# EAGLE board Transfer_Register (EAGLE 9.6.2), part 1 of 2
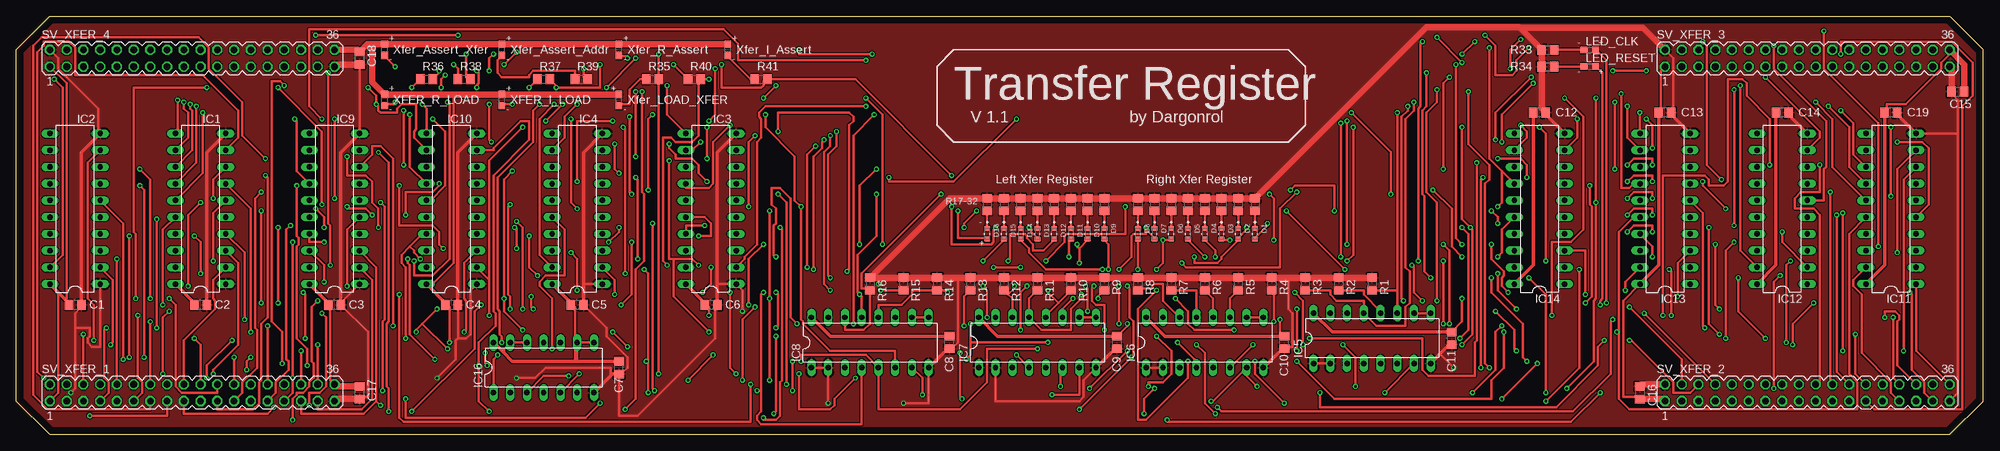
[diagram p1: board, top side]
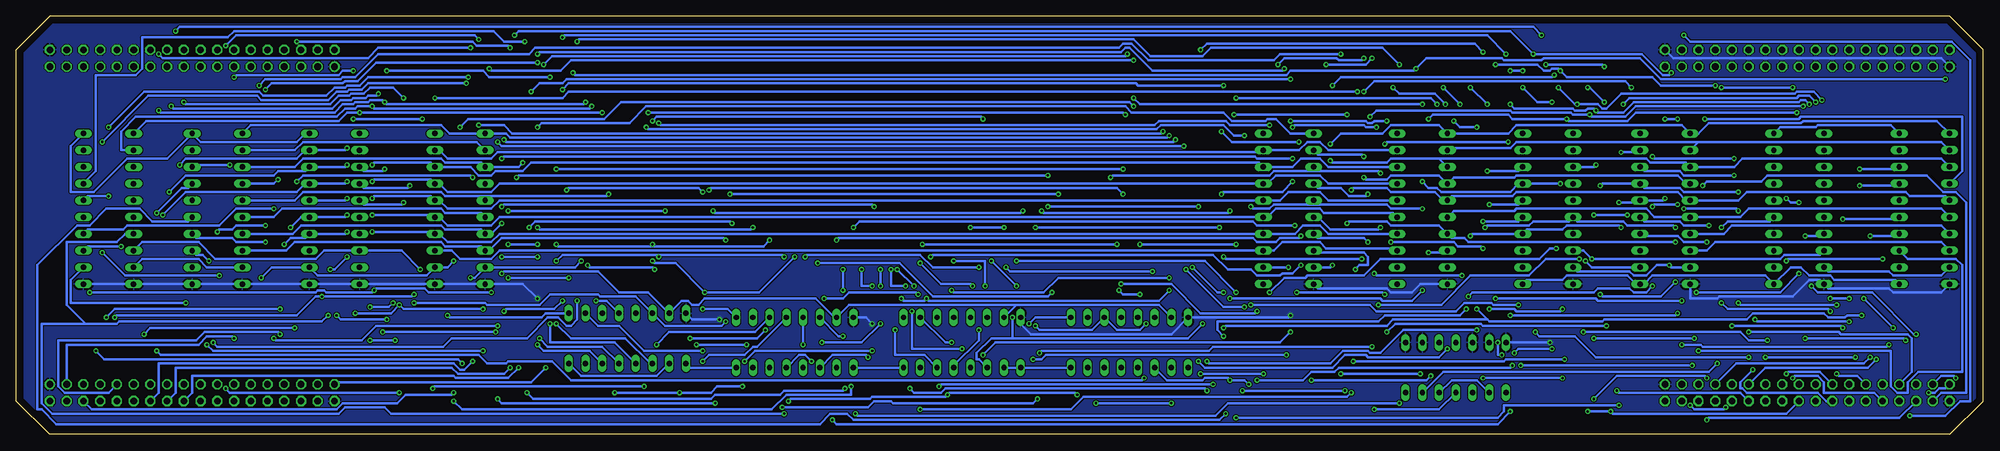
[diagram p2: board, bottom side, seen from below]

Size 298.45 x 63.5 mm. Coordinates in mm from the lower left corner, seen from the top.
Outline: 5.08,0 0,5.08 0,58.42 5.08,63.5 293.37,63.5 298.45,58.42 298.45,5.08 293.37,0 5.08,0
Copper layers (1*16): Top 0.035mm / dielectric 1.5mm / Bottom 0.035mm
Design rules "default *": minimum track width 16mil, minimum drill 0.35mm, track to track 6mil, track to pad 6mil, pad to pad 6mil, via to via 6mil, smd to smd 6mil, copper to edge 40mil, drill to drill 6mil, minimum pad ring 10mil, minimum via ring 8mil, stop-mask expansion 4mil, vias tented up to drill 0mil, thermal gap 10mil

## Footprints (pad centres in the part's own frame; a part is rotated, then mirrored left to right if it is on the bottom)
C0805 = smd 1.3 x 1.5: 1 -0.95,0; 2 0.95,0
LEDC1608X45N = smd 0.81 x 0.93: A 0.81,0; C -0.81,0
DIL20 = drill 0.813 long: 1 -11.43,-3.81; 2 -8.89,-3.81; 3 -6.35,-3.81; 4 -3.81,-3.81; 5 -1.27,-3.81; 6 1.27,-3.81; 7 3.81,-3.81; 8 6.35,-3.81; 9 8.89,-3.81; 10 11.43,-3.81; 11 11.43,3.81; 12 8.89,3.81; 13 6.35,3.81; 14 3.81,3.81; 15 1.27,3.81; 16 -1.27,3.81; 17 -3.81,3.81; 18 -6.35,3.81; 19 -8.89,3.81; 20 -11.43,3.81
DIL16 = drill 0.813 long: 1 -8.89,-3.81; 2 -6.35,-3.81; 3 -3.81,-3.81; 4 -1.27,-3.81; 5 1.27,-3.81; 6 3.81,-3.81; 7 6.35,-3.81; 8 8.89,-3.81; 9 8.89,3.81; 10 6.35,3.81; 11 3.81,3.81; 12 1.27,3.81; 13 -1.27,3.81; 14 -3.81,3.81; 15 -6.35,3.81; 16 -8.89,3.81
DIL14 = drill 0.813 long: 1 -7.62,-3.81; 2 -5.08,-3.81; 3 -2.54,-3.81; 4 0,-3.81; 5 2.54,-3.81; 6 5.08,-3.81; 7 7.62,-3.81; 8 7.62,3.81; 9 5.08,3.81; 10 2.54,3.81; 11 0,3.81; 12 -2.54,3.81; 13 -5.08,3.81; 14 -7.62,3.81
0603 = smd 1.1 x 1: 1 -0.85,0; 2 0.85,0
R0805 = smd 1.3 x 1.5: 1 -0.95,0; 2 0.95,0
MA18-2 = drill 1.016 octagon: 1 -21.59,-1.27; 2 -21.59,1.27; 3 -19.05,-1.27; 4 -19.05,1.27; 5 -16.51,-1.27; 6 -16.51,1.27; 7 -13.97,-1.27; 8 -13.97,1.27; 9 -11.43,-1.27; 10 -11.43,1.27; 11 -8.89,-1.27; 12 -8.89,1.27; 13 -6.35,-1.27; 14 -6.35,1.27; 15 -3.81,-1.27; 16 -3.81,1.27; 17 -1.27,-1.27; 18 -1.27,1.27; 19 1.27,-1.27; 20 1.27,1.27; 21 3.81,-1.27; 22 3.81,1.27; 23 6.35,-1.27; 24 6.35,1.27; 25 8.89,-1.27; 26 8.89,1.27; 27 11.43,-1.27; 28 11.43,1.27; 29 13.97,-1.27; 30 13.97,1.27; 31 16.51,-1.27; 32 16.51,1.27; 33 19.05,-1.27; 34 19.05,1.27; 35 21.59,-1.27; 36 21.59,1.27

## Placement (x,y rotation side)
C1  [C0805]  8.89,19.68 180 top
C2  [C0805]  27.94,19.68 180 top
C3  [C0805]  48.26,19.68 180 top
C4  [C0805]  66.04,19.68 180 top
C5  [C0805]  85.09,19.68 180 top
C6  [C0805]  105.41,19.68 180 top
C7  [C0805]  91.44,10.16 90 top
C8  [C0805]  141.6,13.97 90 top
C9  [C0805]  167,13.97 90 top
C10  [C0805]  192.41,13.97 90 top
C11  [C0805]  217.81,14.61 90 top
C12  [C0805]  231.14,48.9 180 top
C13  [C0805]  250.19,48.9 180 top
C14  [C0805]  267.97,48.9 180 top
C15  [C0805]  294.64,52.07 0 top
C16  [C0805]  246.38,6.35 270 top
C17  [C0805]  52.07,6.35 90 top
C18  [C0805]  52.07,57.15 90 top
C19  [C0805]  284.48,48.9 180 top
D1  LTST-C193KRKT-5A  [LEDC1608X45N]  187.96,30.48 270 top
D2  LTST-C193KRKT-5A  [LEDC1608X45N]  185.42,30.48 270 top
D3  LTST-C193KRKT-5A  [LEDC1608X45N]  182.88,30.48 270 top
D4  LTST-C193KRKT-5A  [LEDC1608X45N]  180.34,30.48 270 top
D5  LTST-C193KRKT-5A  [LEDC1608X45N]  177.8,30.48 270 top
D6  LTST-C193KRKT-5A  [LEDC1608X45N]  175.26,30.48 270 top
D7  LTST-C193KRKT-5A  [LEDC1608X45N]  172.72,30.48 270 top
D8  LTST-C193KRKT-5A  [LEDC1608X45N]  170.18,30.48 270 top
D9  LTST-C193KRKT-5A  [LEDC1608X45N]  165.1,30.48 270 top
D10  LTST-C193KRKT-5A  [LEDC1608X45N]  162.56,30.48 270 top
D11  LTST-C193KRKT-5A  [LEDC1608X45N]  160.02,30.48 270 top
D12  LTST-C193KRKT-5A  [LEDC1608X45N]  157.48,30.48 270 top
D13  LTST-C193KRKT-5A  [LEDC1608X45N]  154.94,30.48 270 top
D14  LTST-C193KRKT-5A  [LEDC1608X45N]  152.4,30.48 270 top
D15  LTST-C193KRKT-5A  [LEDC1608X45N]  149.86,30.48 270 top
D16  LTST-C193KRKT-5A  [LEDC1608X45N]  147.32,30.48 270 top
IC1  74HCT245N  [DIL20]  27.94,34.29 90 top
IC2  74HCT245N  [DIL20]  8.89,34.29 90 top
IC3  74HCT245N  [DIL20]  105.41,34.29 90 top
IC4  74HCT245N  [DIL20]  85.09,34.29 90 top
IC5  74HCT173N  [DIL16]  205.74,14.61 0 top
IC6  74HCT173N  [DIL16]  180.34,13.97 0 top
IC7  74HCT173N  [DIL16]  154.94,13.97 0 top
IC8  74HCT173N  [DIL16]  129.54,13.97 0 top
IC9  74HCT245N  [DIL20]  48.26,34.29 90 top
IC10  74HCT245N  [DIL20]  66.04,34.29 90 top
IC11  74HCT245N  [DIL20]  284.48,34.29 90 top
IC12  74HCT245N  [DIL20]  267.97,34.29 90 top
IC13  74HCT245N  [DIL20]  250.19,34.29 90 top
IC14  74HCT245N  [DIL20]  231.14,34.29 90 top
IC16  74LS266N  [DIL14]  80.01,10.16 0 top
LED_CLK  LTST-C193TBKT-5A  [0603]  238.76,58.42 0 top
LED_RESET  LTST-C193TBKT-5A  [0603]  238.76,55.88 0 top
LED_XFER_ASSERT_ADDR  LTST-C193TBKT-5A  [0603]  73.66,58.42 90 top
LED_XFER_ASSERT_XFER  LTST-C193TBKT-5A  [0603]  55.88,58.42 90 top
LED_XFER_L_ASSERT  LTST-C193TBKT-5A  [0603]  107.95,58.42 90 top
LED_XFER_L_LOAD  LTST-C193TBKT-5A  [0603]  73.66,50.8 90 top
LED_XFER_LOAD_XFER  LTST-C193TBKT-5A  [0603]  91.44,50.8 90 top
LED_XFER_R_ASSERT  LTST-C193TBKT-5A  [0603]  91.44,58.42 90 top
LED_XFER_R_LOAD  LTST-C193TBKT-5A  [0603]  55.88,50.8 90 top
R1  [R0805]  205.74,22.86 270 top
R2  [R0805]  200.66,22.86 270 top
R3  [R0805]  195.58,22.86 270 top
R4  [R0805]  190.5,22.86 270 top
R5  [R0805]  185.42,22.86 270 top
R6  [R0805]  180.34,22.86 270 top
R7  [R0805]  175.26,22.86 270 top
R8  [R0805]  170.18,22.86 270 top
R9  [R0805]  165.1,22.86 270 top
R10  [R0805]  160.02,22.86 270 top
R11  [R0805]  154.94,22.86 270 top
R12  [R0805]  149.86,22.86 270 top
R13  [R0805]  144.78,22.86 270 top
R14  [R0805]  139.7,22.86 270 top
R15  [R0805]  134.62,22.86 270 top
R16  [R0805]  129.54,22.86 270 top
R17  [R0805]  187.96,34.92 270 top
R18  [R0805]  185.42,34.92 270 top
R19  [R0805]  182.88,34.92 270 top
R20  [R0805]  180.34,34.92 270 top
R21  [R0805]  177.8,34.92 270 top
R22  [R0805]  175.26,34.92 270 top
R23  [R0805]  172.72,34.92 270 top
R24  [R0805]  170.18,34.92 270 top
R25  [R0805]  165.1,34.92 270 top
R26  [R0805]  162.56,34.92 270 top
R27  [R0805]  160.02,34.92 270 top
R28  [R0805]  157.48,34.92 270 top
R29  [R0805]  154.94,34.92 270 top
R30  [R0805]  152.4,34.92 270 top
R31  [R0805]  149.86,34.92 270 top
R32  [R0805]  147.32,34.92 270 top
R33  [R0805]  232.41,58.42 0 top
R34  [R0805]  232.41,55.88 0 top
R35  [R0805]  96.52,53.98 0 top
R36  [R0805]  62.23,53.98 0 top
R37  [R0805]  80.01,53.98 0 top
R38  [R0805]  67.94,53.98 0 top
R39  [R0805]  85.72,53.98 0 top
R40  [R0805]  102.87,53.98 0 top
R41  [R0805]  113.03,53.98 0 top
SV_XFER_1  [MA18-2]  26.67,6.35 0 top
SV_XFER_2  [MA18-2]  271.78,6.35 0 top
SV_XFER_3  [MA18-2]  271.78,57.15 0 top
SV_XFER_4  [MA18-2]  26.67,57.15 0 top

## Tracks (layer width: path | path; a pad name or v marks a point on that pad's centre or on a via)
!CTRL_XFER_ASSERT_ADDR  (via drill 0.35)
  Top 0.406: v86.04,55.56 86.04,54.29 86.36,53.98 R39.2 | v5.71,53.98 6.99,52.7 6.99,27.3 IC2.19 | v229.24,11.11 228.6,11.75 228.6,16.83 223.84,21.59 v223.84,23.81 | v214.63,23.81 213.68,24.77 213.68,36.2 213.36,36.51 213.36,49.21 214,49.85 v214,54.93
  Bottom 0.406: v5.71,53.98 48.9,53.98 52.07,57.15 66.67,57.15 66.99,56.83 72.71,56.83 73.03,57.15 84.45,57.15 v86.04,55.56 86.36,55.24 105.09,55.24 105.73,54.61 213.68,54.61 v214,54.93 | IC1.19 23.5,24.77 14.29,24.77 13.65,24.13 6.35,24.13 IC2.19 | SV_XFER_2.23 276.86,6.35 276.86,10.79 232.09,10.79 231.14,9.84 230.5,9.84 v229.24,11.11 | v214.63,23.81 v223.84,23.81
!CTRL_XFER_ASSERT_XFER  (via drill 0.35)
  Top 0.406: v68.26,57.78 68.26,54.29 68.58,53.98 R38.2 | v47.31,54.93 47.31,32.07 47.62,31.75 v47.62,25.72 | SV_XFER_2.25 281.94,3.81 295.27,3.81 295.27,49.85 296.86,51.44 296.86,56.52 293.69,59.69 276.86,59.69 v276.86,57.78 | v229.55,58.74 227.65,56.83 227.65,55.24 227.01,54.61 224.47,54.61 224.47,59.05 v222.88,60.64
  Bottom 0.406: v47.31,54.93 47.62,54.61 48.58,54.61 51.75,57.78 v68.26,57.78 71.75,61.28 222.25,61.28 v222.88,60.64 | IC9.19 47.31,25.4 v47.62,25.72 49.53,25.72 51.12,24.13 53.02,24.13 53.66,24.77 61.59,24.77 IC10.19 | v276.86,57.78 276.23,57.15 245.11,57.15 243.52,58.74 v229.55,58.74
!CTRL_XFER_L_ASSERT  (via drill 0.35)
  Top 0.406: v107,56.2 107,52.7 113.03,52.7 113.35,53.02 113.35,53.66 113.67,53.98 R41.2 127.32,53.98 v141.92,39.37 | v89.53,52.7 v93.98,57.15 | v81.6,50.16 79.38,47.94 79.38,27.3 IC4.19 | v222.25,10.16 222.25,38.73 v222.57,39.05
  Bottom 0.406: v107,56.2 106.05,57.15 98.11,57.15 97.79,56.83 94.3,56.83 v93.98,57.15 | v89.53,52.7 88.58,51.75 83.19,51.75 v81.6,50.16 | SV_XFER_2.19 271.78,6.35 271.78,8.89 232.09,8.89 231.78,8.57 223.84,8.57 v222.25,10.16 | v222.57,39.05 222.25,39.37 v141.92,39.37
!CTRL_XFER_L_LOAD  (via drill 0.35)
  Top 0.406: v79.38,50.16 78.42,49.21 78.42,44.45 73.03,39.05 73.03,19.05 73.34,18.73 73.34,15.24 73.66,14.92 v73.66,13.97 | v73.03,12.06 72.39,11.43 IC16.1 | R37.2 81.92,53.02 v81.92,52.7 88.58,52.7 v88.58,56.2 | v229.55,23.81 232.09,21.27 v232.09,6.35 | v213.36,59.69 213.04,59.37 213.04,49.85 212.72,49.53 v212.72,26.35
  Bottom 0.406: v79.38,50.16 v81.92,52.7 | v73.66,13.97 73.66,12.06 v73.03,12.06 | v229.55,23.81 228.92,23.81 IC14.19 213.68,25.4 v212.72,26.35 | v232.09,6.35 232.41,6.03 239.4,6.03 240.66,4.76 248.92,4.76 249.87,3.81 287.02,3.81 SV_XFER_2.31 | v88.58,56.2 91.12,58.74 117.16,58.74 118.43,57.47 126.36,57.47 128.91,60.01 213.04,60.01 v213.36,59.69
!CTRL_XFER_LOAD_XFER  (via drill 0.35)
  Top 0.406: SV_XFER_2.29 284.48,6.35 284.48,7.94 280.04,12.38 280.04,21.27 278.76,22.54 278.76,23.5 IC11.19 | v97.47,9.21 R35.2 | IC16.5 v85.41,9.21 | IC12.19 261.62,27.94 v261.62,53.02 | R35.2 v97.47,57.78 | R35.2
  Bottom 0.406: IC12.19 269.56,25.4 270.83,26.67 279.4,26.67 IC11.19 | v85.41,9.21 v97.47,9.21 | IC16.2 76.83,8.26 80.64,8.26 IC16.5 | v261.62,53.02 260.67,53.98 249.24,53.98 248.92,54.29 247.01,54.29 243.52,57.78 220.66,57.78 219.71,58.74 131.13,58.74 130.49,59.37 129.22,59.37 126.68,56.83 107.63,56.83 106.68,57.78 v97.47,57.78
!CTRL_XFER_R_ASSERT  (via drill 0.35)
  Top 0.406: v98.74,25.72 98.11,26.35 98.11,45.09 99.38,45.09 100.01,44.45 102.55,44.45 103.5,45.4 103.5,53.98 R40.2 v105.09,53.98 | v223.52,10.16 222.88,10.79 222.88,38.1 223.52,38.73 223.52,40.96 220.34,44.13 v220.34,52.07
  Bottom 0.406: v98.74,25.72 99.06,25.4 IC3.19 | SV_XFER_2.21 274.32,6.35 274.32,10.16 232.41,10.16 231.46,9.21 224.47,9.21 v223.52,10.16 | v220.34,52.07 219.07,53.34 215.58,53.34 214.95,53.98 v105.09,53.98
!CTRL_XFER_R_LOAD  (via drill 0.35)
  Top 0.406: IC13.19 244.16,23.18 v244.16,21.91 | v287.34,21.59 287.65,21.27 287.65,9.84 289.56,7.94 289.56,6.35 SV_XFER_2.33 | v64.14,55.24 64.14,54.93 R36.2 | v40.64,53.02 40.01,53.66 38.73,53.66 38.73,17.14 40.32,15.56 v40.32,10.79 | v226.38,21.59 225.43,22.54 225.43,23.81 225.74,24.13 225.74,24.77 223.84,26.67 v223.84,28.89 | v219.39,28.89 218.44,29.84 v218.44,56.2 | v129.86,57.78 118.75,57.78 v118.75,58.42 | v73.98,56.2 v75.88,58.1
  Bottom 0.406: v287.34,21.59 253.05,21.59 252.73,21.91 251.78,21.91 251.46,21.59 244.47,21.59 v244.16,21.91 243.84,22.23 236.54,22.23 235.9,21.59 v226.38,21.59 | v40.64,53.02 48.9,53.02 50.16,54.29 63.18,54.29 v64.14,55.24 64.45,55.56 65.41,55.56 65.72,55.24 66.67,55.24 67.63,56.2 v73.98,56.2 | v40.32,10.79 41.59,9.53 81.92,9.53 IC16.6 | v219.39,28.89 v223.84,28.89 | v218.44,56.2 217.17,57.47 130.18,57.47 v129.86,57.78 | v118.75,58.42 117.79,59.37 77.15,59.37 v75.88,58.1
BUS_!CLK  (via drill 0.35)
  Top 0.406: IC8.7 137.48,8.57 v137.48,6.03 | v157.16,6.03 161.29,6.03 IC7.7 | 186.06,9.53 181.61,5.08 v181.29,5.08 | v207.65,6.35 IC5.7 | 186.06,9.53 v188.28,7.3 | 186.06,9.53 IC6.7 | SV_XFER_2.6 254,6.35 251.46,6.35 251.46,7.94 245.11,14.29 v244.79,14.29 | v240.98,14.29 240.03,13.34 240.03,10.48 233.68,4.13 197.8,4.13 v197.8,6.35
  Bottom 0.406: v137.48,6.03 137.79,6.35 156.84,6.35 v157.16,6.03 157.48,5.71 168.59,5.71 168.91,5.4 180.97,5.4 v181.29,5.08 | v207.65,6.35 v197.8,6.35 193.04,6.35 192.09,7.3 v188.28,7.3 | v240.98,14.29 v244.79,14.29
BUS_ADDRESS_BUS_0  (via drill 0.35)
  Top 0.406: IC1.9 33.66,45.09 33.66,49.21 28.26,54.61 8.89,54.61 8.89,58.74 7.94,59.69 4.13,59.69 4.13,59.05 3.17,58.1 3.17,9.53 v4.13,8.57
  Bottom 0.406: v4.13,8.57 4.45,8.89 6.35,8.89 SV_XFER_1.4
BUS_ADDRESS_BUS_1  (via drill 0.35)
  Top 0.406: IC1.8 29.84,38.73 v29.84,35.88 | v27.94,35.24 26.04,33.34 v26.04,22.54 | SV_XFER_1.6 v10.16,15.24
  Bottom 0.406: v29.84,35.88 29.21,35.24 v27.94,35.24 | v26.04,22.54 25.08,21.59 16.83,21.59 10.48,15.24 v10.16,15.24
BUS_ADDRESS_BUS_2  (via drill 0.35)
  Top 0.406: IC1.7 35.56,34.29 v35.56,15.56
  Bottom 0.406: v35.56,15.56 21.91,15.56 21.59,15.24 11.43,15.24 10.79,14.61 10.79,9.53 SV_XFER_1.8
BUS_ADDRESS_BUS_3  (via drill 0.35)
  Top 0.406: IC1.6 29.84,33.66 v29.84,26.35 | SV_XFER_1.10 v15.24,26.67
  Bottom 0.406: v29.84,26.35 29.53,26.67 v15.24,26.67
BUS_ADDRESS_BUS_4  (via drill 0.35)
  Top 0.406: v39.69,20 v39.69,31.43 | v23.18,18.73 22.23,17.78 v22.23,9.21
  Bottom 0.406: IC1.5 32.38,32.38 38.73,32.38 v39.69,31.43 | v39.69,20 38.73,19.05 23.5,19.05 v23.18,18.73 | v22.23,9.21 21.91,8.89 19.05,8.89 SV_XFER_1.12
BUS_ADDRESS_BUS_5  (via drill 0.35)
  Top 0.406: IC1.4 34.61,27.62 v34.61,17.46 | SV_XFER_1.14 v20.32,17.14
  Bottom 0.406: v34.61,17.46 34.29,17.14 v20.32,17.14
BUS_ADDRESS_BUS_6  (via drill 0.35)
  Top 0.406: IC1.3 33.66,26.04 33.66,13.65 29.84,9.84 v29.84,9.21
  Bottom 0.406: v29.84,9.21 29.53,9.53 24.77,9.53 SV_XFER_1.16
BUS_ADDRESS_BUS_7
  Top 0.406: IC1.2 29.84,23.5 29.84,20.64 30.16,20.32 30.16,19.05 25.4,14.29 SV_XFER_1.18
BUS_ADDRESS_BUS_8  (via drill 0.35)
  Top 0.406: IC2.9 10.79,41.27 10.79,20.64 11.75,19.68 v11.75,14.29 | v26.99,14.61 27.94,13.65 SV_XFER_1.20
  Bottom 0.406: v11.75,14.29 12.06,14.61 v26.99,14.61
BUS_ADDRESS_BUS_9  (via drill 0.35)
  Top 0.406: v18.73,40.32 20.32,38.73 v20.32,20.64 | v23.18,20.64 24.13,19.68 24.13,7.3 25.08,6.35 30.48,6.35 SV_XFER_1.22
  Bottom 0.406: IC2.8 13.02,40.32 v18.73,40.32 | v23.18,20.64 v20.32,20.64
BUS_ADDRESS_BUS_10  (via drill 0.35)
  Top 0.406: v18.73,37.78 19.37,37.15 v19.37,11.75 | SV_XFER_1.24 v33.02,11.75
  Bottom 0.406: IC2.7 13.02,37.78 v18.73,37.78 | v33.02,11.75 v19.37,11.75
BUS_ADDRESS_BUS_11  (via drill 0.35)
  Top 0.406: IC2.6 16.19,32.07 v16.19,11.43
  Bottom 0.406: v16.19,11.43 17.46,10.16 33.02,10.16 SV_XFER_1.26
BUS_ADDRESS_BUS_12  (via drill 0.35)
  Top 0.406: v21.27,16.19 v21.27,32.7 | SV_XFER_1.28 v38.1,16.51
  Bottom 0.406: IC2.5 13.02,32.7 v21.27,32.7 | v21.27,16.19 21.59,16.51 v38.1,16.51
BUS_ADDRESS_BUS_13  (via drill 0.35)
  Top 0.406: v17.14,11.75 v17.14,30.16
  Bottom 0.406: IC2.4 13.02,30.16 v17.14,30.16 | v17.14,11.75 18.1,10.79 37.47,10.79 SV_XFER_1.30
BUS_ADDRESS_BUS_14  (via drill 0.35)
  Top 0.406: SV_XFER_1.32 v43.18,12.7
  Bottom 0.406: IC2.3 11.43,26.67 4.13,26.67 3.17,25.72 3.17,9.53 9.84,9.53 11.43,7.94 11.43,6.35 13.02,6.35 13.97,7.3 13.97,12.7 v43.18,12.7
BUS_ADDRESS_BUS_15  (via drill 0.35)
  Top 0.406: IC2.2 14.61,23.5 14.61,13.97 v14.29,13.65 | SV_XFER_1.34 v45.72,13.65
  Bottom 0.406: v14.29,13.65 14.61,13.34 42.55,13.34 42.86,13.65 v45.72,13.65
BUS_CLK  (via drill 0.35)
  Top 0.406: LED_CLK.2 239.71,58.42 241.3,56.83 v241.3,20 | v244.79,19.37 252.73,11.43 SV_XFER_2.4
  Bottom 0.406: v241.3,20 241.94,19.37 v244.79,19.37
BUS_MAIN_BUS_0  (via drill 0.35)
  Top 0.406: IC14.9 236.85,45.09 v236.85,47.94 | v247.33,47.94 248.28,46.99 v248.28,43.5 | SV_XFER_2.20 273.69,8.26 273.69,33.34 272.73,34.29 269.88,34.29 269.88,35.88 270.83,36.83 273.69,36.83 v273.69,40.96
  Bottom 0.406: IC4.9 99.38,43.18 100.65,44.45 102.55,44.45 103.82,43.18 IC3.9 109.54,42.86 225.43,42.86 226.38,41.91 233.04,41.91 234.31,43.18 IC14.9 | v247.33,47.94 v236.85,47.94 | v248.28,43.5 248.6,43.18 IC13.9 254.63,43.18 255.91,41.91 272.73,41.91 v273.69,40.96
BUS_MAIN_BUS_1  (via drill 0.35)
  Top 0.406: v244.47,40.96 245.43,41.91 248.28,41.91 v248.28,40.96 | SV_XFER_2.22 275.27,7.94 v275.27,36.83
  Bottom 0.406: IC4.8 99.38,40.64 100.65,41.91 103.5,41.91 104.78,40.64 IC3.8 109.86,41.27 220.34,41.27 221.62,40.01 225.74,40.01 226.38,39.37 228.28,39.37 229.55,40.64 IC14.8 235.59,41.27 244.16,41.27 v244.47,40.96 | v248.28,40.96 248.6,40.64 IC13.8 254.63,40.01 258.76,40.01 259.4,39.37 272.73,39.37 v275.27,36.83
BUS_MAIN_BUS_2  (via drill 0.35)
  Top 0.406: v244.47,38.42 245.43,39.37 248.28,39.37 v248.28,38.42 | SV_XFER_2.24 276.23,9.53 v276.23,33.34
  Bottom 0.406: IC4.7 99.38,38.1 100.65,39.37 107.31,39.37 108.58,38.1 IC3.7 225.11,38.1 226.38,36.83 233.04,36.83 234.31,38.1 IC14.7 235.59,38.73 244.16,38.73 v244.47,38.42 | v248.28,38.42 248.6,38.1 IC13.7 254.63,38.1 255.91,36.83 272.73,36.83 v276.23,33.34
BUS_MAIN_BUS_3  (via drill 0.35)
  Top 0.406: v244.47,35.88 245.43,36.83 248.28,36.83 v248.28,35.88 | SV_XFER_2.26 279.08,9.21 v279.08,15.24 | v256.22,16.19 255.91,16.51 255.91,33.66 IC13.6
  Bottom 0.406: IC4.6 99.38,35.56 100.65,36.83 105.41,36.83 106.68,35.56 IC3.6 225.11,35.56 226.38,34.29 233.04,34.29 234.31,35.56 IC14.6 235.59,36.2 244.16,36.2 v244.47,35.88 | v248.28,35.88 248.6,35.56 IC13.6 | v279.08,15.24 278.13,16.19 v256.22,16.19
BUS_MAIN_BUS_4  (via drill 0.35)
  Top 0.406: v244.47,33.34 245.43,34.29 248.28,34.29 v248.28,33.34 | v258.44,15.24 256.86,16.83 v256.86,31.43
  Bottom 0.406: IC4.5 89.53,33.66 100.01,33.66 100.65,34.29 107.31,34.29 108.58,33.02 IC3.5 225.11,33.02 226.38,31.75 233.04,31.75 234.31,33.02 IC14.5 235.27,33.34 v244.47,33.34 | v248.28,33.34 248.6,33.02 IC13.5 255.27,33.02 v256.86,31.43 | SV_XFER_2.28 284.48,6.35 291.15,6.35 292.1,7.3 292.1,14.29 271.14,14.29 269.88,15.56 258.76,15.56 v258.44,15.24
BUS_MAIN_BUS_5  (via drill 0.35)
  Top 0.406: v244.47,30.8 245.43,31.75 248.28,31.75 v248.28,30.8 | SV_XFER_2.30 284.8,8.57 v284.8,17.78 | v258.44,19.05 257.81,19.68 v257.81,28.89
  Bottom 0.406: IC4.4 99.38,30.48 100.65,31.75 103.19,31.75 104.46,30.48 IC3.4 225.11,30.48 226.38,29.21 233.04,29.21 234.31,30.48 IC14.4 235.27,30.8 v244.47,30.8 | v248.28,30.8 248.6,30.48 IC13.4 254.63,29.84 256.86,29.84 v257.81,28.89 | v284.8,17.78 283.53,19.05 v258.44,19.05
BUS_MAIN_BUS_6  (via drill 0.35)
  Top 0.406: IC14.3 238.12,27.94 v238.12,21.27 | v252.09,20.95 252.09,26.04 IC13.3 | SV_XFER_2.32 285.43,10.48 285.43,17.14 285.75,17.46 285.75,18.1 285.12,18.73 283.53,18.73 v283.53,17.78
  Bottom 0.406: IC4.3 89.22,28.26 99.69,28.26 100.65,29.21 106.36,29.21 107.63,27.94 IC3.3 225.11,27.94 226.38,26.67 231.14,26.67 232.41,27.94 IC14.3 | v238.12,21.27 238.44,20.95 v252.09,20.95 253.05,20.95 255.91,18.1 283.21,18.1 v283.53,17.78
BUS_MAIN_BUS_7  (via drill 0.35)
  Top 0.406: IC4.2 90.81,23.5 v90.81,21.27 | v104.14,21.59 105.41,22.86 v105.41,25.4 | v265.43,14.61 261.3,18.73 v261.3,23.81 | IC3.2 110.49,26.67 110.49,26.99 112.39,28.89 112.39,44.45 113.03,45.09 113.03,47.94 112.71,48.26 112.71,48.9 113.67,49.85 v128.91,49.85 | v231.14,46.67 232.09,45.72 v232.09,26.35
  Bottom 0.406: v90.81,21.27 91.12,21.59 v104.14,21.59 | IC3.2 v105.41,25.4 | SV_XFER_2.34 290.83,13.65 270.83,13.65 269.56,14.92 265.75,14.92 v265.43,14.61 | v261.3,23.81 259.71,25.4 IC13.2 252.73,24.13 236.22,24.13 IC14.2 233.04,25.4 v232.09,26.35 | v128.91,49.85 129.54,50.48 206.69,50.48 209.23,47.94 229.87,47.94 v231.14,46.67
BUS_RESET  (via drill 0.35)
  Top 0.406: v240.35,19.68 240.35,20.32 240.66,20.64 240.66,54.93 239.71,55.88 LED_RESET.2 | SV_XFER_2.8 v247.01,18.41 | v227.65,19.05 224.79,21.91 v224.79,24.45
  Bottom 0.406: v247.01,18.41 241.62,18.41 v240.35,19.68 239.71,19.05 v227.65,19.05 | IC8.15 125.09,19.68 146.69,19.68 | IC7.15 146.69,19.68 | 146.69,19.68 172.09,19.68 IC6.15 174.31,17.78 177.16,20.64 193.99,20.64 194.94,19.68 195.9,19.68 196.53,20.32 197.49,20.32 IC5.15 202.56,21.59 207.01,21.59 210.19,24.77 224.47,24.77 v224.79,24.45
BUS_XFER_BUS_0  (via drill 0.35)
  Top 0.406: IC10.9 72.39,43.18 72.39,43.5 76.52,47.62 77.79,47.62 77.79,44.77 72.39,39.37 72.39,18.73 72.71,18.41 72.71,16.51 70.17,13.97 v70.17,10.48 70.17,5.08 v71.75,3.49 | v44.13,10.48 44.13,13.02 42.55,14.61 42.55,28.57 42.86,28.89 42.86,29.84 42.55,30.16 v42.55,37.78 | IC11.9 285.43,40.32 v285.43,27.62 | v267.65,24.13 266.7,23.18 v266.7,6.99 | v240.35,6.35 235.9,1.91 174.62,1.91 v174.62,2.22
  Bottom 0.406: v44.13,10.48 v70.17,10.48 | v42.55,37.78 41.91,38.42 33.66,38.42 32.7,39.37 8.57,39.37 6.03,36.83 4.13,36.83 2.54,35.24 2.54,6.35 6.35,6.35 SV_XFER_1.3 | v285.43,27.62 281.94,24.13 v267.65,24.13 | v266.7,6.99 266.06,6.35 v240.35,6.35 | v174.62,2.22 173.99,1.59 73.66,1.59 v71.75,3.49
BUS_XFER_BUS_1  (via drill 0.35)
  Top 0.406: v75.25,40.01 73.98,38.73 v73.98,20.64 73.98,18.73 v76.83,15.88 | v45.72,20.32 44.77,19.37 44.77,11.11 45.09,10.79 45.09,8.57 44.45,7.94 44.45,7.3 43.5,6.35 42.55,6.35 42.55,6.03 41.91,5.4 v41.91,2.22 | IC11.8 286.38,38.73 v286.38,12.7 | v225.43,5.4 v230.82,10.79 | v192.41,4.76 187.96,9.21 v187.96,11.11 | v162.88,6.99 v168.59,12.7 | v117.79,11.11 v117.79,6.67
  Bottom 0.406: IC10.8 70.48,40.01 v75.25,40.01 | v73.98,20.64 58.74,20.64 58.42,20.32 v45.72,20.32 | v41.91,2.22 41.59,2.54 12.7,2.54 SV_XFER_1.5 | v286.38,12.7 285.12,11.43 231.46,11.43 v230.82,10.79 | v225.43,5.4 224.79,4.76 v192.41,4.76 | v187.96,11.11 186.37,12.7 v168.59,12.7 | v162.88,6.99 162.24,6.35 158.12,6.35 157.48,6.99 118.11,6.99 v117.79,6.67 | v117.79,11.11 117.47,10.79 99.06,10.79 97.16,12.7 93.34,12.7 93.03,12.38 91.44,12.38 87.95,15.88 v76.83,15.88
BUS_XFER_BUS_2  (via drill 0.35)
  Top 0.406: v64.14,38.1 64.14,37.78 63.18,36.83 59.05,36.83 v59.05,33.34 | v53.98,33.34 53.02,34.29 50.16,34.29 v50.16,34.61 | v46.35,34.92 46.35,46.04 v39.69,52.7 | v28.89,52.7 17.78,52.7 17.78,30.8 18.1,30.48 v18.1,20.64 | v13.65,16.19 13.34,15.88 13.34,8.57 13.97,7.94 13.97,6.35 SV_XFER_1.7 | v219.39,57.78 v221.3,59.69 | v106.05,55.56 106.05,48.58 v105.09,47.62 | v90.49,47.62 85.09,47.62 v85.09,38.42
  Bottom 0.406: v64.14,38.1 IC10.7 70.48,38.1 71.75,36.83 82.23,36.83 82.87,37.47 84.14,37.47 v85.09,38.42 | v53.98,33.34 v59.05,33.34 | v50.16,34.61 49.85,34.92 v46.35,34.92 | v28.89,52.7 v39.69,52.7 | v13.65,16.19 v18.1,20.64 | IC11.7 286.38,40.01 286.38,54.61 280.35,54.61 279.4,55.56 279.4,60.33 266.38,60.33 265.43,61.28 226.06,61.28 224.47,59.69 v221.3,59.69 | v219.39,57.78 219.07,58.1 130.81,58.1 130.18,58.74 129.54,58.74 126.05,55.24 106.36,55.24 v106.05,55.56 | v105.09,47.62 93.66,47.62 93.34,47.31 92.71,47.31 92.39,47.62 v90.49,47.62
BUS_XFER_BUS_3  (via drill 0.35)
  Top 0.406: v74.93,34.92 74.61,34.61 74.61,21.27 74.93,20.95 v74.93,19.05 | 61.59,16.83 60.64,15.88 v60.64,15.56 | 61.59,16.83 v63.82,19.05 | v32.7,14.29 28.89,10.48 v28.89,8.57 | v284.48,46.67 v284.48,36.2 | v229.87,54.29 224.47,48.9 v224.47,44.77 | v122.56,44.77 122.24,44.45 122.24,43.5 120.97,42.23 v120.97,25.08 | v112.08,19.37 110.17,17.46 v110.17,8.26 | v71.44,10.48 71.12,10.79 v71.12,12.38 | 61.59,16.83 v65.41,13.02
  Bottom 0.406: IC10.6 70.48,34.92 v74.93,34.92 | v74.93,19.05 71.12,19.05 70.8,18.73 64.14,18.73 v63.82,19.05 | v60.64,15.56 36.83,15.56 35.56,14.29 v32.7,14.29 | v28.89,8.57 28.57,8.89 25.08,8.89 24.13,7.94 24.13,6.35 16.51,6.35 SV_XFER_1.9 | IC11.6 287.65,36.2 v284.48,36.2 | v284.48,46.67 279.08,52.07 261.62,52.07 260.99,51.44 251.46,51.44 250.19,52.7 248.6,52.7 248.28,53.02 246.38,53.02 245.11,54.29 v229.87,54.29 | v224.47,44.77 224.16,44.45 122.87,44.45 v122.56,44.77 | v120.97,25.08 115.25,19.37 v112.08,19.37 | v110.17,8.26 103.19,8.26 101.92,9.53 98.42,9.53 97.79,10.16 71.75,10.16 v71.44,10.48 | v71.12,12.38 70.48,13.02 v65.41,13.02
BUS_XFER_BUS_4  (via drill 0.35)
  Top 0.406: v75.88,32.38 76.83,31.43 v76.83,19.05 | v18.41,18.1 18.41,8.57 19.05,7.94 19.05,6.35 SV_XFER_1.11 | IC11.5 290.19,34.92 290.19,43.5 289.24,44.45 v285.43,44.45 | v230.19,53.34 225.43,48.58 v225.43,44.45 | v121.28,43.81 120.02,42.55 v120.02,25.4 | v115.25,21.59 115.57,21.27 115.57,16.51 v115.25,16.19
  Bottom 0.406: IC10.5 70.48,32.38 v75.88,32.38 | 75.25,17.46 74.93,17.14 57.78,17.14 57.47,17.46 35.88,17.46 34.92,18.41 24.13,18.41 23.5,17.78 20.95,17.78 20.64,18.1 v18.41,18.1 | 75.25,17.46 v76.83,19.05 | v285.43,44.45 278.45,51.44 261.94,51.44 261.3,50.8 251.14,50.8 249.87,52.07 248.28,52.07 247.97,52.39 246.06,52.39 245.11,53.34 v230.19,53.34 | v225.43,44.45 224.79,43.81 v121.28,43.81 | v120.02,25.4 116.2,21.59 v115.25,21.59 | v115.25,16.19 114.94,16.51 90.49,16.51 89.53,17.46 75.25,17.46
BUS_XFER_BUS_5  (via drill 0.35)
  Top 0.406: v54.93,31.43 54.93,34.29 53.98,35.24 53.98,38.42 53.02,39.37 50.16,39.37 v50.16,42.23 | v37.78,41.91 34.29,45.4 34.29,50.48 29.21,55.56 29.21,58.74 27.62,60.33 3.81,60.33 2.54,59.05 2.54,6.03 4.76,3.81 20.32,3.81 SV_XFER_1.13 | v259.4,34.29 255.91,37.78 v255.91,38.42 | v229.24,39.05 229.24,40.96 228.28,41.91 v224.79,41.91 | v104.78,46.67 v104.78,41.91 | v92.08,46.67 92.39,46.35 v92.39,24.45 | v79.06,24.13 77.79,25.4 v77.79,30.16
  Bottom 0.406: v54.93,31.43 55.24,31.75 63.18,31.75 63.82,31.11 69.22,31.11 IC10.4 77.47,30.48 v77.79,30.16 | v50.16,42.23 49.85,41.91 v37.78,41.91 | IC11.4 287.65,31.11 282.26,31.11 281.62,31.75 267.65,31.75 265.11,34.29 v259.4,34.29 | v255.91,38.42 254.95,39.37 229.55,39.37 v229.24,39.05 | v224.79,41.91 224.47,42.23 110.49,42.23 110.17,41.91 v104.78,41.91 | v104.78,46.67 104.46,46.99 93.98,46.99 93.66,46.67 v92.08,46.67 | v92.39,24.45 92.08,24.13 v79.06,24.13
BUS_XFER_BUS_6  (via drill 0.35)
  Top 0.406: IC10.3 67.94,26.04 67.94,20.64 68.26,20.32 68.26,15.88 v67.94,15.56 | v35.56,11.75 34.92,11.11 v34.92,9.84 | v282.57,28.57 282.57,47.31 274.32,55.56 v274.32,61.28 | v45.4,60.64 v66.99,60.64 | v11.11,2.86 22.86,2.86 SV_XFER_1.15
  Bottom 0.406: v67.94,15.56 67.31,14.92 61.91,14.92 58.74,11.75 v35.56,11.75 | v34.92,9.84 36.83,7.94 36.83,6.99 36.51,6.99 35.88,6.35 25.08,6.35 23.81,5.08 SV_XFER_1.15 | IC11.3 287.65,28.57 v282.57,28.57 | v274.32,61.28 273.69,61.91 68.26,61.91 v66.99,60.64 | v45.4,60.64 44.45,59.69 4.76,59.69 1.91,56.83 1.91,5.08 3.49,5.08 5.71,2.86 v11.11,2.86
BUS_XFER_BUS_7  (via drill 0.35)
  Top 0.406: 71.75,23.5 IC10.2 | v71.75,18.1 71.75,23.5 | v46.35,18.41 46.99,17.78 46.99,7.3 46.04,6.35 44.45,6.35 v44.45,4.45 | v39.05,4.13 38.1,3.17 25.4,3.17 SV_XFER_1.17 | v272.73,20 269.56,16.83 v269.56,13.65 | v227.65,12.7 227.33,13.02 227.33,15.88 v224.47,18.73 | v215.58,20.32 215.58,35.24 214,36.83 214,48.9 215.58,50.48 v215.58,52.39 | v113.35,51.12 v115.25,53.02 | v80.33,47.62 v82.87,50.16 | v76.83,46.67 71.75,41.59 71.75,23.5
  Bottom 0.406: v71.75,18.1 46.67,18.1 v46.35,18.41 | v44.45,4.45 43.81,3.81 39.37,3.81 v39.05,4.13 | IC11.2 290.19,23.5 290.19,20 v272.73,20 | v269.56,13.65 268.61,12.7 v227.65,12.7 | v224.47,18.73 224.16,19.05 216.85,19.05 v215.58,20.32 | v215.58,52.39 214.63,53.34 128.59,53.34 128.27,53.02 v115.25,53.02 | v113.35,51.12 83.82,51.12 v82.87,50.16 | v80.33,47.62 79.38,46.67 v76.83,46.67
BUS_XFER_BUS_8  (via drill 0.35)
  Top 0.406: v54.93,42.86 56.52,41.27 56.52,17.14 56.2,16.83 56.2,7.3 56.52,6.99 v56.52,3.49 | IC12.9 273.69,45.09 273.69,46.04 v265.43,54.29 | v242.25,55.24 v247.33,55.24 | v217.49,54.29 216.53,53.34 v216.53,40.32 | v130.49,40.32 127.95,37.78 v127.95,28.89 | v113.35,28.89 111.12,26.67 v111.12,19.68 | v70.48,19.68 69.53,18.73 69.53,13.02 v60.01,3.49
  Bottom 0.406: IC9.9 52.39,42.86 v54.93,42.86 | SV_XFER_1.19 29.84,3.17 56.2,3.17 v56.52,3.49 v60.01,3.49 | v265.43,54.29 265.11,54.61 249.56,54.61 248.92,55.24 v247.33,55.24 | v242.25,55.24 227.65,55.24 226.69,54.29 v217.49,54.29 | v130.49,40.32 v216.53,40.32 | v113.35,28.89 v127.95,28.89 | v111.12,19.68 93.03,19.68 92.08,18.73 80.01,18.73 78.74,20 74.61,20 74.3,19.68 v70.48,19.68
BUS_XFER_BUS_9  (via drill 0.35)
  Top 0.406: v37.78,39.37 38.1,39.05 38.1,17.78 37.15,16.83 37.15,8.26 36.83,7.94 36.83,4.76 35.88,3.81 30.48,3.81 SV_XFER_1.21 | v266.06,40.96 266.06,47.94 262.57,51.44 262.57,53.34 261.94,53.98 259.71,53.98 259.71,38.42 259.08,37.78 256.86,37.78 256.86,38.73 256.22,39.37 249.87,39.37 v249.87,18.1 | v242.25,17.46 241.94,17.14 241.94,9.21 236.22,3.49 182.88,3.49 v182.25,4.13 | v143.51,5.4 143.19,5.71 v143.19,12.38 | v90.49,15.56 v92.71,13.34 | v57.15,16.51 57.15,41.91 55.24,43.81 53.98,43.81 53.98,42.55 IC9.8
  Bottom 0.406: IC9.8 51.44,40.01 46.04,40.01 45.4,39.37 v37.78,39.37 | IC12.8 271.46,40.96 v266.06,40.96 | v249.87,18.1 249.24,17.46 v242.25,17.46 | v182.25,4.13 169.23,4.13 168.28,5.08 165.74,5.08 165.42,4.76 144.15,4.76 v143.51,5.4 | v143.19,12.38 142.88,12.7 117.47,12.7 116.84,13.34 v92.71,13.34 | v90.49,15.56 89.22,16.83 76.2,16.83 75.88,16.51 v57.15,16.51
BUS_XFER_BUS_10  (via drill 0.35)
  Top 0.406: v37.15,36.83 36.2,35.88 36.2,16.19 36.51,15.88 36.51,10.16 34.29,7.94 34.29,6.35 SV_XFER_1.23 | v277.18,12.7 v277.18,33.66 | v127.32,8.57 124.14,5.4 124.14,4.45 123.51,3.81 118.75,3.81 v118.75,9.21 | v109.22,9.21 108.27,10.16 v108.27,21.59 | v64.77,28.26 64.14,28.89 64.14,30.8 63.18,31.75 58.1,31.75 v58.1,37.78
  Bottom 0.406: v37.15,36.83 45.4,36.83 46.04,37.47 51.44,37.47 IC9.7 57.78,38.1 v58.1,37.78 | IC12.7 272.42,37.47 273.37,37.47 v277.18,33.66 | v277.18,12.7 276.54,12.06 228.28,12.06 227.01,10.79 224.16,10.79 223.84,11.11 217.17,11.11 214.31,8.26 127.64,8.26 v127.32,8.57 | v109.22,9.21 v118.75,9.21 | v108.27,21.59 106.05,23.81 102.87,23.81 102.55,24.13 93.98,24.13 91.44,26.67 67.31,26.67 65.72,28.26 v64.77,28.26
BUS_XFER_BUS_11  (via drill 0.35)
  Top 0.406: v55.24,35.24 55.88,34.61 55.88,17.46 55.56,17.14 v55.56,6.67 | IC12.6 274.32,35.56 274.32,40.32 274.64,40.64 274.64,47.62 266.7,55.56 v266.7,59.05 | v228.28,60.01 226.69,58.42 v226.69,55.56 | v128.91,56.83 109.54,56.83 109.54,59.37 107.31,61.59 44.45,61.59 44.45,49.85 v46.35,47.94 | v48.26,35.88 v48.26,47.94
  Bottom 0.406: v55.24,35.24 52.39,35.24 IC9.6 48.58,35.56 v48.26,35.88 | v55.56,6.67 55.24,6.35 36.83,6.35 SV_XFER_1.25 | v266.7,59.05 265.11,60.64 228.92,60.64 v228.28,60.01 | v226.69,55.56 226.38,55.24 215.9,55.24 214.31,56.83 v128.91,56.83 | v48.26,47.94 v46.35,47.94
BUS_XFER_BUS_12  (via drill 0.35)
  Top 0.406: v41.59,31.75 40.96,31.11 40.96,11.43 41.27,11.11 41.27,9.84 39.37,7.94 39.37,6.35 SV_XFER_1.27 | v114.94,3.17 115.25,3.49 v115.25,14.92 | v78.42,19.05 78.11,19.37 v78.11,20.95 | v50.16,22.54 50.16,31.11 IC9.5
  Bottom 0.406: IC9.5 51.44,32.38 46.04,32.38 45.4,31.75 v41.59,31.75 | IC12.5 272.42,32.38 277.81,32.38 279.72,34.29 284.8,34.29 287.34,31.75 289.24,31.75 295.27,25.72 295.27,3.81 294.64,3.81 292.42,1.59 176.53,1.59 174.94,3.17 172.4,3.17 171.45,2.22 115.89,2.22 v114.94,3.17 | v115.25,14.92 116.2,15.88 116.2,17.14 91.76,17.14 90.81,18.1 79.38,18.1 v78.42,19.05 | v78.11,20.95 77.47,21.59 59.05,21.59 58.42,22.23 53.66,22.23 53.02,21.59 51.12,21.59 v50.16,22.54
BUS_XFER_BUS_13  (via drill 0.35)
  Top 0.406: v41.91,29.21 v41.91,8.57 41.91,6.35 SV_XFER_1.29 | v260.67,29.21 259.4,27.94 v259.4,14.61 | v225.43,16.51 224.47,15.56 224.47,9.84 v220.98,6.35 | v172.72,6.99 171.13,5.4 v171.13,3.17 | v88.58,4.76 86.36,2.54 59.05,2.54 v59.05,5.4
  Bottom 0.406: IC9.4 51.75,30.16 46.35,30.16 45.4,29.21 v41.91,29.21 | IC12.4 271.14,29.84 265.75,29.84 265.11,29.21 v260.67,29.21 | v259.4,14.61 259.08,14.29 246.06,14.29 243.84,16.51 v225.43,16.51 | v220.98,6.35 220.03,5.4 193.04,5.4 192.41,6.03 182.56,6.03 181.93,6.67 173.04,6.67 v172.72,6.99 | v171.13,3.17 170.81,2.86 116.52,2.86 114.62,4.76 v88.58,4.76 | v59.05,5.4 55.56,8.89 42.23,8.89 v41.91,8.57
BUS_XFER_BUS_14  (via drill 0.35)
  Top 0.406: IC9.3 54.61,25.4 54.61,5.08 | 54.61,5.08 52.7,3.17 43.18,3.17 SV_XFER_1.31 | v269.24,26.35 268.61,25.72 v268.61,13.97 | v213.36,20.32 212.09,21.59 212.09,25.4 v211.77,25.72 | v192.72,33.97 v201.61,25.08 | v145.73,33.97 143.83,32.07 v143.83,31.43 | v115.89,31.43 116.2,31.11 116.2,8.26 115.89,7.94 115.89,2.86 115.25,2.22 113.35,2.22 v113.35,2.54 | 54.61,5.08 v55.24,4.45
  Bottom 0.406: IC12.3 271.14,27.3 270.19,27.3 v269.24,26.35 | v268.61,13.97 267.97,13.34 233.68,13.34 232.41,14.61 220.98,14.61 217.81,17.78 216.22,17.78 214.95,16.51 214.31,16.51 213.36,17.46 v213.36,20.32 | v211.77,25.72 211.46,25.4 201.93,25.4 v201.61,25.08 | v192.72,33.97 192.41,33.66 146.05,33.66 v145.73,33.97 | v115.89,31.43 v143.83,31.43 | v113.35,2.54 73.66,2.54 72.71,3.49 72.71,4.45 v55.24,4.45
BUS_XFER_BUS_15  (via drill 0.35)
  Top 0.406: IC9.2 53.98,23.5 53.98,5.4 52.39,3.81 45.72,3.81 SV_XFER_1.33 | IC12.2 267.97,29.21 v267.97,30.8 | v260.67,52.39 v260.67,31.75 | v215.58,60.33 v219.39,56.52 | v72.39,57.78 71.75,57.15 v71.75,55.24 | v69.85,55.24 70.17,54.93 70.17,53.34 69.85,53.02 v69.85,52.7 | v65.41,50.48 65.72,50.16 65.72,26.67 63.18,24.13 60.33,24.13 v60.33,26.35
  Bottom 0.406: v267.97,30.8 267.65,31.11 265.75,31.11 265.11,31.75 v260.67,31.75 | v260.67,52.39 259.71,53.34 248.92,53.34 248.6,53.66 246.7,53.66 243.84,56.52 v219.39,56.52 | v215.58,60.33 215.26,60.64 75.25,60.64 v72.39,57.78 | v69.85,55.24 v71.75,55.24 | v69.85,52.7 67.63,50.48 v65.41,50.48 | v60.33,26.35 59.37,25.4 IC9.2
GND  (via drill 0.35)
  Top 0.406: v8.26,6.35 8.89,6.99 8.89,16.19 | 8.89,16.19 8.89,18.41 9.53,19.05 9.53,19.68 C1.1 | SV_XFER_4.2 6.35,57.15 6.35,55.56 12.38,49.53 12.38,45.72 IC2.10 | IC10.1 68.9,21.91 68.9,15.24 68.26,14.61 66.99,14.61 | 66.99,14.61 C4.1 | IC9.1 49.21,20 C3.1 53.34,15.56 53.34,5.71 52.39,5.71 C17.1 | C18.1 IC9.10 | 8.89,16.19 11.11,16.19 11.11,14.92 10.79,14.61 10.79,13.97 11.43,13.34 12.7,13.34 IC2.1 | SV_XFER_2.35 294.64,6.35 294.64,45.72 | 294.64,45.72 294.64,50.8 294,51.44 294,51.75 C15.1 | 294.64,45.72 IC11.10 | 106.36,22.86 IC3.1 110.17,21.91 v110.17,18.73 | 86.04,22.86 IC4.1 | C5.1 89.53,16.19 89.53,14.92 92.71,11.75 92.71,10.16 92.08,9.53 91.44,9.53 C7.1 91.44,2.86 94.3,2.86 106.05,14.61 106.05,19.68 C6.1 | 216.06,12.22 v218.12,10.16 | IC5.2 IC5.1 | IC6.2 IC6.1 | SV_XFER_3.2 251.46,57.15 251.46,49.21 C13.1 | IC8.1 IC8.2 v123.19,4.76 | v134.62,4.76 138.43,4.76 IC8.8 | 142.88,23.81 142.88,13.97 142.24,13.34 141.6,13.34 C8.1 | IC7.8 161.93,8.26 161.93,5.71 161.29,5.08 148.59,5.08 IC7.2 | 193.04,23.81 193.04,19.05 193.68,18.41 193.68,13.34 192.41,13.34 C10.1 | 130.81,23.81 v130.81,22.86 | 66.99,14.61 66.67,14.29 66.67,11.43 v63.82,8.57 | v75.88,8.57 78.74,8.57 80.33,10.16 90.17,10.16 90.17,9.21 90.33,9.05
  Top 0.508: C1.1 9.84,42.86 IC2.10 | C2.1 28.89,42.86 IC1.10 | C3.1 49.21,42.86 IC9.10 | C4.1 66.99,42.86 IC10.10 | C5.1 86.04,22.86 86.04,42.86 IC4.10 | C6.1 106.36,22.86 106.36,42.86 IC3.10 | C7.1 90.49,9.21 90.33,9.05 IC16.7 | C8.1 141.29,13.02 IC8.8 | C9.1 166.69,13.02 IC7.8 | C10.1 192.09,13.02 IC6.8 | C11.1 217.49,13.65 216.06,12.22 IC5.8 | C12.1 232.09,48.58 IC14.10 | C13.1 251.14,48.58 IC13.10 | C14.1 268.92,48.58 IC12.10 | C19.1 285.43,48.58 IC11.10
  Top 1.016: R1.1 R2.1 R3.1 193.04,23.81 R4.1 R5.1 R6.1 R7.1 R8.1 R9.1 R10.1 R11.1 R12.1 R13.1 142.88,23.81 R14.1 R15.1 130.81,23.81 R16.1 141.6,35.88 R32.1 R31.1 R30.1 R29.1 R28.1 R27.1 R26.1 R25.1 R24.1 R23.1 R22.1 R21.1 R20.1 R19.1 R18.1 R17.1 213.99,61.9 227.98,61.9 228.12,61.76 | 228.12,61.76 R33.1 R34.1 231.46,49.96 231.5,49.92 231.5,49.48 C12.1 | 228.12,61.76 246.85,61.76 SV_XFER_3.2 | C18.1 48.58,56.2 SV_XFER_4.35 | C16.1 246.7,7.62 SV_XFER_2.2 | C17.1 48.58,5.4 SV_XFER_1.35 | C15.1 293.69,55.56 SV_XFER_3.35
  Bottom 0.406: SV_XFER_1.2 5.71,6.99 6.67,6.99 7.3,6.35 v8.26,6.35 | IC1.10 30.8,46.67 25.4,46.67 25.08,46.99 13.97,46.99 IC2.10 | IC2.1 13.34,23.5 22.54,23.5 23.18,24.13 26.35,24.13 27.62,25.4 29.21,25.4 IC1.1 33.02,24.13 50.16,24.13 51.44,22.86 IC9.1 52.7,22.86 53.98,24.13 63.18,24.13 63.82,23.5 69.22,23.5 IC10.1 | SV_XFER_2.2 249.87,7.94 220.34,7.94 v218.12,10.16 | IC5.1 196.22,10.16 IC6.8 | IC7.8 IC6.1 | IC7.2 IC7.1 IC8.8 | v134.62,4.76 v123.19,4.76 | IC13.10 254.63,45.72 255.91,44.45 270.51,44.45 IC12.10 275.59,41.91 281.62,41.91 286.7,36.83 290.19,36.83 290.19,43.81 IC11.10 | IC5.8 212.72,8.89 201.29,8.89 IC5.2 | v110.17,18.73 110.49,18.41 118.75,18.41 123.19,22.86 v130.81,22.86 | v75.88,8.57 v63.82,8.57
  pour Top: -2.54,59.69 3.81,66.04 5.08,66.04 294.64,66.04 300.99,59.69 300.99,3.81 294.64,-2.54 3.81,-2.54 -2.54,3.81
N$1
  Top 0.406: R33.2 LED_CLK.1
N$2
  Top 0.406: R34.2 LED_RESET.1
N$3
  Top 0.406: R35.1 94.61,53.98 93.03,52.39 93.03,50.16 91.44,50.16 LED_XFER_LOAD_XFER.1
N$4  (via drill 0.35)
  Top 0.406: v57.47,50.48 57.47,50.16 55.88,50.16 LED_XFER_R_LOAD.1 | v60.01,52.7 R36.1
  Bottom 0.406: v57.47,50.48 59.69,52.7 v60.01,52.7
N$5  (via drill 0.35)
  Top 0.406: v75.25,50.16 73.66,50.16 LED_XFER_L_LOAD.1 | v77.79,52.7 R37.1
  Bottom 0.406: v77.79,52.7 v75.25,50.16
N$6  (via drill 0.35)
  Top 0.406: v57.47,55.88 55.88,57.47 LED_XFER_ASSERT_XFER.1 | v66.36,56.2 66.99,55.56 R38.1
  Bottom 0.406: v57.47,55.88 57.78,56.2 v66.36,56.2
N$7
  Top 0.406: LED_XFER_ASSERT_ADDR.1 73.66,57.47 73.03,56.83 73.03,54.93 73.66,54.29 77.79,54.29 77.79,54.61 78.42,55.24 84.77,55.24 R39.1
N$8  (via drill 0.35)
  Top 0.406: v92.71,57.15 92.71,57.47 91.44,57.47 LED_XFER_R_ASSERT.1 | v99.69,56.2 R40.1
  Bottom 0.406: v92.71,57.15 93.66,56.2 v99.69,56.2
N$9
  Top 0.406: R41.1 111.44,53.98 107.95,57.47 LED_XFER_L_ASSERT.1
N$38  (via drill 0.35)
  Top 0.406: v142.88,33.97 142.88,29.84 147.32,29.84 D16.A | v114.3,8.26 v114.3,20.64 v114.3,33.97 | v84.14,27.62 85.09,26.67 v85.09,21.91 | IC9.18 46.67,25.72 v46.67,23.18 | v58.1,21.27 58.1,2.54 58.74,1.91 111.44,1.91 v111.44,7.62
  Bottom 0.406: IC2.18 6.35,29.21 40.64,29.21 41.91,27.94 IC9.18 | v142.88,33.97 142.56,33.66 114.62,33.66 v114.3,33.97 | IC8.3 123.83,8.26 118.43,8.26 118.11,8.57 114.62,8.57 v114.3,8.26 112.08,8.26 v111.44,7.62 | IC4.18 81.6,27.62 v84.14,27.62 | v85.09,21.91 86.68,20.32 91.12,20.32 91.44,20.64 v114.3,20.64 | v46.67,23.18 48.9,20.95 57.78,20.95 v58.1,21.27
N$39  (via drill 0.35)
  Top 0.406: v146.69,26.35 149.86,29.53 D15.A | v113.35,21.59 113.03,21.27 113.03,6.67 | 113.03,6.67 113.03,3.49 112.39,2.86 112.39,2.22 113.03,1.59 128.27,1.59 IC8.4 | v46.67,29.21 44.45,29.21 IC9.17 | v112.39,6.67 113.03,6.67 | v96.84,6.67 96.52,6.99 v96.52,32.07
  Bottom 0.406: v146.69,26.35 118.11,26.35 v113.35,21.59 | IC2.17 6.35,31.75 38.1,31.75 39.37,30.48 IC9.17 | v46.67,29.21 78.11,29.21 78.74,29.84 80.64,29.84 IC4.17 82.55,31.75 89.85,31.75 90.49,32.38 96.2,32.38 v96.52,32.07 | v96.84,6.67 v112.39,6.67
N$40  (via drill 0.35)
  Top 0.406: v164.78,25.08 156.21,25.08 153.67,27.62 153.67,28.26 152.4,29.53 D14.A | v162.24,22.54 162.56,22.23 v162.56,18.73 | v154.94,13.02 147.32,13.02 147.32,7.94 143.19,3.81 130.81,3.81 IC8.5 128.91,12.06 119.06,12.06 v119.06,11.11 | v81.28,13.02 81.28,20.64 79.38,22.54 79.38,23.18 80.33,24.13 83.19,24.13 83.19,31.11 IC4.16
  Bottom 0.406: v162.24,22.54 v164.78,25.08 | v162.56,18.73 162.56,13.02 v154.94,13.02 | IC2.16 6.35,34.29 35.56,34.29 36.83,33.02 IC9.16 49.85,33.02 51.12,34.29 70.8,34.29 71.12,33.97 80.33,33.97 IC4.16 | v119.06,11.11 118.11,10.16 98.74,10.16 96.84,12.06 93.66,12.06 93.34,11.75 82.55,11.75 v81.28,13.02
N$41  (via drill 0.35)
  Top 0.406: v153.67,31.43 153.67,31.11 154.94,29.84 D13.A | v148.59,31.43 148.27,31.11 148.27,29.21 147.96,28.89 141.92,28.89 v141.92,34.61 | IC8.6 133.35,12.7 123.51,12.7 119.38,16.83 119.38,17.14 119.06,17.46 v119.06,34.61 118.11,35.56 118.11,42.23 113.67,46.67 v113.67,48.58 | v96.52,48.58 95.89,47.94 v95.89,37.15
  Bottom 0.406: v148.59,31.43 v153.67,31.43 | v119.06,34.61 v141.92,34.61 | IC2.15 5.71,36.2 11.11,36.2 11.75,36.83 35.88,36.83 37.15,35.56 IC9.15 45.09,35.56 46.35,36.83 70.8,36.83 71.44,36.2 80.64,36.2 IC4.15 81.92,35.56 83.19,36.83 89.85,36.83 90.49,37.47 95.57,37.47 v95.89,37.15 | v96.52,48.58 v113.67,48.58
N$42  (via drill 0.35)
  Top 0.406: v150.5,26.35 150.81,26.67 150.81,30.48 153.03,30.48 153.35,30.16 153.35,29.84 154.31,28.89 154.31,27.94 155.89,27.94 157.48,29.53 D12.A | v146.69,22.54 147.32,21.91 v147.32,17.78 | v42.23,47.94 42.55,47.62 42.55,40.01 IC9.14 | v118.43,16.83 117.47,17.78 117.47,35.88 115.89,37.47 114.62,37.47 114.62,34.92 115.25,34.29 115.25,32.07 114.94,31.75 114.94,27.3 v115.25,26.99 | v94.3,26.67 94.3,38.73 v93.98,39.05
  Bottom 0.406: v146.69,22.54 v150.5,26.35 | 147.32,14.61 v147.32,17.78 | 147.32,14.61 150.5,14.61 152.72,12.38 152.72,11.43 152.4,11.43 IC7.3 | IC2.14 3.17,40.01 3.17,48.26 27.62,48.26 27.94,47.94 v42.23,47.94 | IC9.14 45.09,38.1 46.35,39.37 70.8,39.37 71.12,39.05 80.33,39.05 IC4.14 82.55,39.37 89.85,39.37 90.49,38.73 93.66,38.73 v93.98,39.05 | 147.32,14.61 120.65,14.61 v118.43,16.83 | v115.25,26.99 114.94,26.67 v94.3,26.67
N$43  (via drill 0.35)
  Top 0.406: v159.7,26.99 159.7,29.21 160.02,29.53 D11.A | v103.5,25.72 102.55,26.67 99.69,26.67 | 99.69,26.67 99.06,26.67 v99.06,41.59 | v151.76,12.06 IC7.4 | v105.09,15.56 99.69,20.95 99.69,26.67
  Bottom 0.406: IC2.13 6.35,41.91 36.51,41.91 37.78,40.64 IC9.13 45.09,41.27 50.48,41.27 51.12,41.91 82.55,41.91 | v159.7,26.99 159.38,27.3 116.84,27.3 114.62,25.08 111.12,25.08 110.17,24.13 106.68,24.13 106.36,24.45 104.78,24.45 v103.5,25.72 | v99.06,41.59 98.74,41.27 90.49,41.27 89.85,41.91 82.55,41.91 | IC4.13 82.55,41.91 | v151.76,12.06 149.86,13.97 106.68,13.97 v105.09,15.56
N$44  (via drill 0.35)
  Top 0.406: 161.29,28.26 162.56,29.53 D10.A | v161.29,26.04 161.29,28.26 | v153.35,22.54 152.4,21.59 v152.4,15.88 | 161.29,28.26 160.97,28.57 v160.97,28.89 | v131.44,28.89 131.44,48.58 v128.91,51.12 | v85.09,50.16 83.19,48.26 83.19,45.09 IC4.12
  Bottom 0.406: v161.29,26.04 158.12,22.86 153.67,22.86 v153.35,22.54 | v152.4,15.88 152.4,14.29 156.21,10.48 IC7.5 | IC2.12 6.35,44.45 43.18,44.45 | IC9.12 43.18,44.45 | IC4.12 80.96,43.5 71.75,43.5 70.8,44.45 43.18,44.45 | v131.44,28.89 v160.97,28.89 | v128.91,51.12 127.95,50.16 v85.09,50.16
N$45  (via drill 0.35)
  Top 0.406: v165.74,25.08 165.74,28.89 165.1,29.53 D9.A | v163.51,22.54 163.19,22.23 163.19,20.32 163.83,19.68 165.1,19.68 v165.1,15.88 | IC7.6 158.43,9.84 v158.43,7.3 | v116.84,7.62 116.84,35.24 v115.57,36.51 | v104.78,38.42 103.5,39.69 103.5,40.96 102.55,41.91 100.01,41.91 100.01,42.55 99.06,43.5 v99.06,44.13
  Bottom 0.406: v165.74,25.08 165.74,22.54 v163.51,22.54 | v165.1,15.88 165.1,12.06 160.66,12.06 IC7.6 | IC2.11 6.99,47.62 27.3,47.62 27.62,47.31 41.59,47.31 43.18,45.72 IC9.11 45.72,46.99 70.8,46.99 72.07,45.72 IC4.11 82.55,46.99 89.85,46.99 91.12,45.72 97.47,45.72 v99.06,44.13 | v158.43,7.3 158.12,7.62 v116.84,7.62 | v115.57,36.51 115.25,36.83 106.36,36.83 v104.78,38.42
N$46  (via drill 0.35)
  Top 0.406: v170.18,25.08 D8.A | v168.59,22.54 168.91,22.23 168.91,17.78 169.54,17.14 169.54,12.06 v169.23,11.75 v161.29,3.81 | v95.25,25.08 95.89,24.45 95.89,11.11 | v95.89,6.35 95.89,11.11 | v59.37,26.67 59.37,26.04 59.69,25.72 59.69,15.24 v63.5,11.43 | 95.89,11.11 v95.57,11.11
  Bottom 0.406: IC1.18 24.77,27.3 30.16,27.3 30.8,26.67 v59.37,26.67 60.64,27.94 IC10.18 | v170.18,25.08 170.18,22.54 v168.59,22.54 | v169.23,11.75 169.54,12.06 174.62,12.06 IC6.3 | IC3.18 101.28,27.62 93.98,27.62 93.34,26.99 93.34,25.72 94.61,25.72 v95.25,25.08 | v95.89,6.35 96.52,5.71 136.53,5.71 138.43,3.81 v161.29,3.81 | v63.5,11.43 72.39,11.43 72.71,11.11 v95.57,11.11
N$47  (via drill 0.35)
  Top 0.406: v26.99,30.16 27.94,29.21 v27.94,24.45 | v43.5,21.59 43.81,21.27 v43.81,14.61 | v59.05,14.61 59.05,25.4 58.42,26.04 58.42,27.3 59.69,28.57 | 59.69,28.57 61.59,30.48 IC10.17 | 171.45,31.11 172.72,29.84 D7.A | v104.46,31.75 101.6,31.75 IC3.17 | IC6.4 178.75,10.48 178.75,11.43 v176.21,13.97 | v167.32,22.54 v167.32,16.83 | v167.32,25.08 169.23,26.99 169.23,30.16 169.54,30.48 171.45,30.48 171.45,31.11 | 171.45,31.11 v171.45,31.43 | 59.69,28.57 60.33,27.94 60.33,27.62 v61.28,26.67 | v91.76,19.68 93.34,21.27 v93.34,29.21
  Bottom 0.406: IC1.17 24.45,30.16 v26.99,30.16 | v27.94,24.45 30.8,21.59 v43.5,21.59 | v59.05,14.61 v43.81,14.61 | v171.45,31.43 170.5,32.38 110.81,32.38 110.17,31.75 v104.46,31.75 | v176.21,13.97 170.18,13.97 v167.32,16.83 | v167.32,25.08 v167.32,22.54 | v61.28,26.67 66.36,26.67 68.9,24.13 77.79,24.13 82.23,19.68 v91.76,19.68 | v93.34,29.21 93.98,29.84 100.97,29.84 IC3.17
N$48  (via drill 0.35)
  Top 0.406: IC1.16 22.23,31.11 v22.23,19.68 | v37.15,33.97 v37.15,20 | v45.4,34.29 46.67,33.02 v46.67,31.43 | v103.5,30.16 105.41,30.16 105.41,32.07 104.46,33.02 IC3.16 | D6.A 175.26,29.53 v173.99,29.53 173.99,26.04 v173.04,25.08 | v177.8,11.11 177.8,8.57 171.45,2.22 170.18,2.22 170.18,19.05 v173.04,21.91 | v75.56,31.43 75.88,31.11 v75.88,28.26 | v89.85,29.21 91.44,30.8 v91.44,31.43
  Bottom 0.406: v22.23,19.68 36.83,19.68 v37.15,20 | v37.15,33.97 37.47,34.29 v45.4,34.29 | v46.67,31.43 46.99,31.75 53.98,31.75 54.61,32.38 61.59,32.38 IC10.16 62.87,32.38 68.26,32.38 68.9,31.75 75.25,31.75 v75.56,31.43 | v173.99,29.53 173.67,29.84 110.81,29.84 110.17,29.21 107.31,29.21 106.68,29.84 103.82,29.84 v103.5,30.16 | IC6.5 179.71,12.06 178.75,12.06 v177.8,11.11 | v173.04,25.08 v173.04,21.91 | v75.88,28.26 76.2,28.57 79.69,28.57 80.33,29.21 v89.85,29.21 | v91.44,31.43 91.76,31.11 99.06,31.11 100.97,33.02 IC3.16
N$49  (via drill 0.35)
  Top 0.406: v180.34,26.99 177.8,29.53 D5.A | v193.99,21.59 195.26,20.32 v195.26,13.65 | IC6.6 v187.64,13.65 | IC1.15 28.26,39.69 v28.26,48.9 | v63.18,47.94 65.09,46.04 65.09,37.78 62.87,35.56 IC10.15 | v85.09,34.29 84.14,35.24 v84.14,47.94 | v201.93,26.35 202.88,27.3 v202.88,46.67 | v112.08,45.4 111.12,44.45 v111.12,34.61
  Bottom 0.406: v180.34,26.99 185.74,21.59 v193.99,21.59 198.44,26.04 201.61,26.04 v201.93,26.35 | v187.64,13.65 v195.26,13.65 | v28.26,48.9 52.7,48.9 53.98,47.62 62.87,47.62 v63.18,47.94 71.44,47.94 72.07,48.58 83.5,48.58 v84.14,47.94 | 100.97,34.92 90.49,34.92 89.85,34.29 v85.09,34.29 | v202.88,46.67 202.56,46.35 125.41,46.35 124.78,46.99 115.25,46.99 113.67,45.4 v112.08,45.4 | v111.12,34.61 110.81,34.29 108.27,34.29 107.63,34.92 100.97,34.92 | 100.97,34.92 IC3.15
N$50  (via drill 0.35)
  Top 0.406: v181.93,26.99 181.93,27.94 180.34,29.53 D4.A | v216.53,16.83 v216.53,26.35 | IC1.14 27.3,41.27 v27.3,49.85 | v59.69,48.58 59.69,40.64 IC10.14 | v93.34,36.51 93.03,36.83 v93.03,48.26 | v200.98,47.31 v200.98,26.99 | v108.27,46.99 105.73,44.45 105.73,38.1 105.09,37.47 101.6,37.47 IC3.14
  Bottom 0.406: v181.93,26.99 182.25,27.3 200.98,27.3 | 200.98,27.3 215.58,27.3 v216.53,26.35 | v216.53,16.83 214.31,14.61 206.06,14.61 202.25,10.79 IC5.3 | v27.3,49.85 52.7,49.85 54.29,48.26 59.37,48.26 v59.69,48.58 62.23,48.58 62.55,48.9 71.44,48.9 71.75,49.21 92.08,49.21 v93.03,48.26 | IC3.14 100.97,37.47 97.47,37.47 96.2,36.2 93.66,36.2 v93.34,36.51 | v200.98,26.99 200.98,27.3 | v200.98,47.31 200.66,46.99 125.73,46.99 125.09,47.62 114.94,47.62 114.3,46.99 v108.27,46.99
N$51  (via drill 0.35)
  Top 0.406: v184.15,29.53 182.88,29.53 D3.A | v216.53,28.89 217.49,27.94 v217.49,16.83 | IC1.13 26.67,43.18 26.67,49.21 26.35,49.53 v26.35,50.16 | v58.74,40.96 v58.74,49.21 | v91.44,39.69 90.81,40.32 v90.81,44.13 | v72.07,44.45 71.75,44.77 v71.75,50.16 | v201.93,47.62 v201.93,28.89 | v151.76,47.94 142.24,38.42 132.4,38.42 v132.4,39.05
  Bottom 0.406: v184.15,29.53 185.1,28.57 201.93,28.57 | 201.93,28.57 216.22,28.57 v216.53,28.89 | v217.49,16.83 217.49,13.97 207.65,13.97 IC5.4 | v26.35,50.16 26.99,50.8 27.62,50.8 27.94,50.48 53.02,50.48 54.61,48.9 58.42,48.9 v58.74,49.21 59.05,49.53 60.01,49.53 60.33,49.21 61.91,49.21 62.23,49.53 71.12,49.53 v71.75,50.16 | v58.74,40.96 59.05,40.64 IC10.13 | 100.97,40.01 91.76,40.01 v91.44,39.69 | v90.81,44.13 90.49,44.45 v72.07,44.45 | v201.93,28.89 201.93,28.57 | v201.93,47.62 201.29,48.26 152.08,48.26 v151.76,47.94 | v132.4,39.05 132.08,39.37 108.27,39.37 107.63,40.01 100.97,40.01 | 100.97,40.01 IC3.13
N$52  (via drill 0.35)
  Top 0.406: v186.69,31.43 186.69,31.11 185.42,29.84 D2.A 185.42,29.53 182.88,26.99 182.88,26.67 182.25,26.04 178.75,26.04 v178.75,26.99 | v219.39,31.43 220.34,30.48 220.34,15.88 v219.07,14.61 | IC1.12 26.04,45.09 26.04,48.9 25.4,49.53 v25.4,50.48 | IC10.12 60.33,45.09 60.33,46.04 60.64,46.35 60.64,50.16 58.42,50.16 57.78,49.53 57.78,48.9 55.24,48.9 54.93,49.21 54.93,49.85 v54.61,50.16 54.61,51.44 v53.34,52.7 | v93.98,52.07 v93.98,42.23 | v148.27,25.4 v152.4,25.4 | v126.05,24.77 126.36,25.08 126.36,46.99 127,47.62 127,48.26 126.36,48.9 115.57,48.9 v115.57,46.04 | v103.82,44.45 102.55,43.18 IC3.12
  Bottom 0.406: v186.69,31.43 187.01,31.11 219.07,31.11 v219.39,31.43 | v219.07,14.61 217.81,13.34 209.55,13.34 IC5.5 | v25.4,50.48 26.35,51.44 27.94,51.44 28.26,51.12 53.66,51.12 v54.61,50.16 | IC3.12 100.97,42.55 94.3,42.55 v93.98,42.23 | v93.98,52.07 92.39,53.66 54.29,53.66 v53.34,52.7 | v178.75,26.99 178.44,27.3 161.29,27.3 159.38,25.4 v152.4,25.4 | v148.27,25.4 147.64,24.77 v126.05,24.77 | v115.57,46.04 113.98,44.45 v103.82,44.45
N$53  (via drill 0.35)
  Top 0.406: v189.87,32.07 189.87,31.75 187.96,29.84 D1.A | v219.39,13.65 220.98,15.24 220.98,31.11 v220.66,31.43 219.39,32.7 v219.39,46.67 | IC1.11 24.45,46.04 v24.45,50.8 | v61.59,50.16 62.23,49.53 IC10.11 | IC3.11 98.74,48.58 v98.74,53.02 | v65.09,54.61 64.45,53.98 v64.45,52.7
  Bottom 0.406: v189.87,32.07 190.18,32.38 219.71,32.38 v220.66,31.43 | v219.39,13.65 218.44,12.7 211.46,12.7 IC5.6 | v24.45,50.8 25.72,52.07 28.26,52.07 28.57,51.75 54.93,51.75 57.15,49.53 57.78,49.53 58.42,50.16 v61.59,50.16 61.91,50.16 v64.45,52.7 | v98.74,53.02 97.47,54.29 65.41,54.29 v65.09,54.61 | v219.39,46.67 218.76,47.31 205.42,47.31 202.88,49.85 130.18,49.85 129.22,48.9 115.25,48.9 113.98,47.62 108.9,47.62 108.58,47.94 107.31,47.94 105.09,45.72 IC3.11
N$55  (via drill 0.35)
  Top 0.406: v164.15,20.64 164.15,20.95 R9.2 | v160.34,20.64 158.75,19.05 IC7.11 | v123.51,21.91 122.56,22.86 122.56,42.86 123.51,43.81 v123.51,45.4
  Bottom 0.406: v164.15,20.64 163.83,20.32 160.66,20.32 v160.34,20.64 160.02,20.32 125.09,20.32 v123.51,21.91 | IC12.11 262.89,46.99 234,46.99 232.73,45.72 IC14.11 224.16,45.72 223.52,45.09 123.83,45.09 v123.51,45.4
N$56  (via drill 0.35)
  Top 0.406: 158.12,20 156.21,18.1 IC7.12 | 158.12,20 R10.2 | 158.12,20 156.53,21.59 v156.53,21.91 | v123.51,23.81 123.19,24.13 123.19,42.55 124.46,43.81 v124.46,46.04 | v228.28,46.99 229.24,46.04 229.24,45.09 IC14.12